# Altium project placagps.PrjPcb
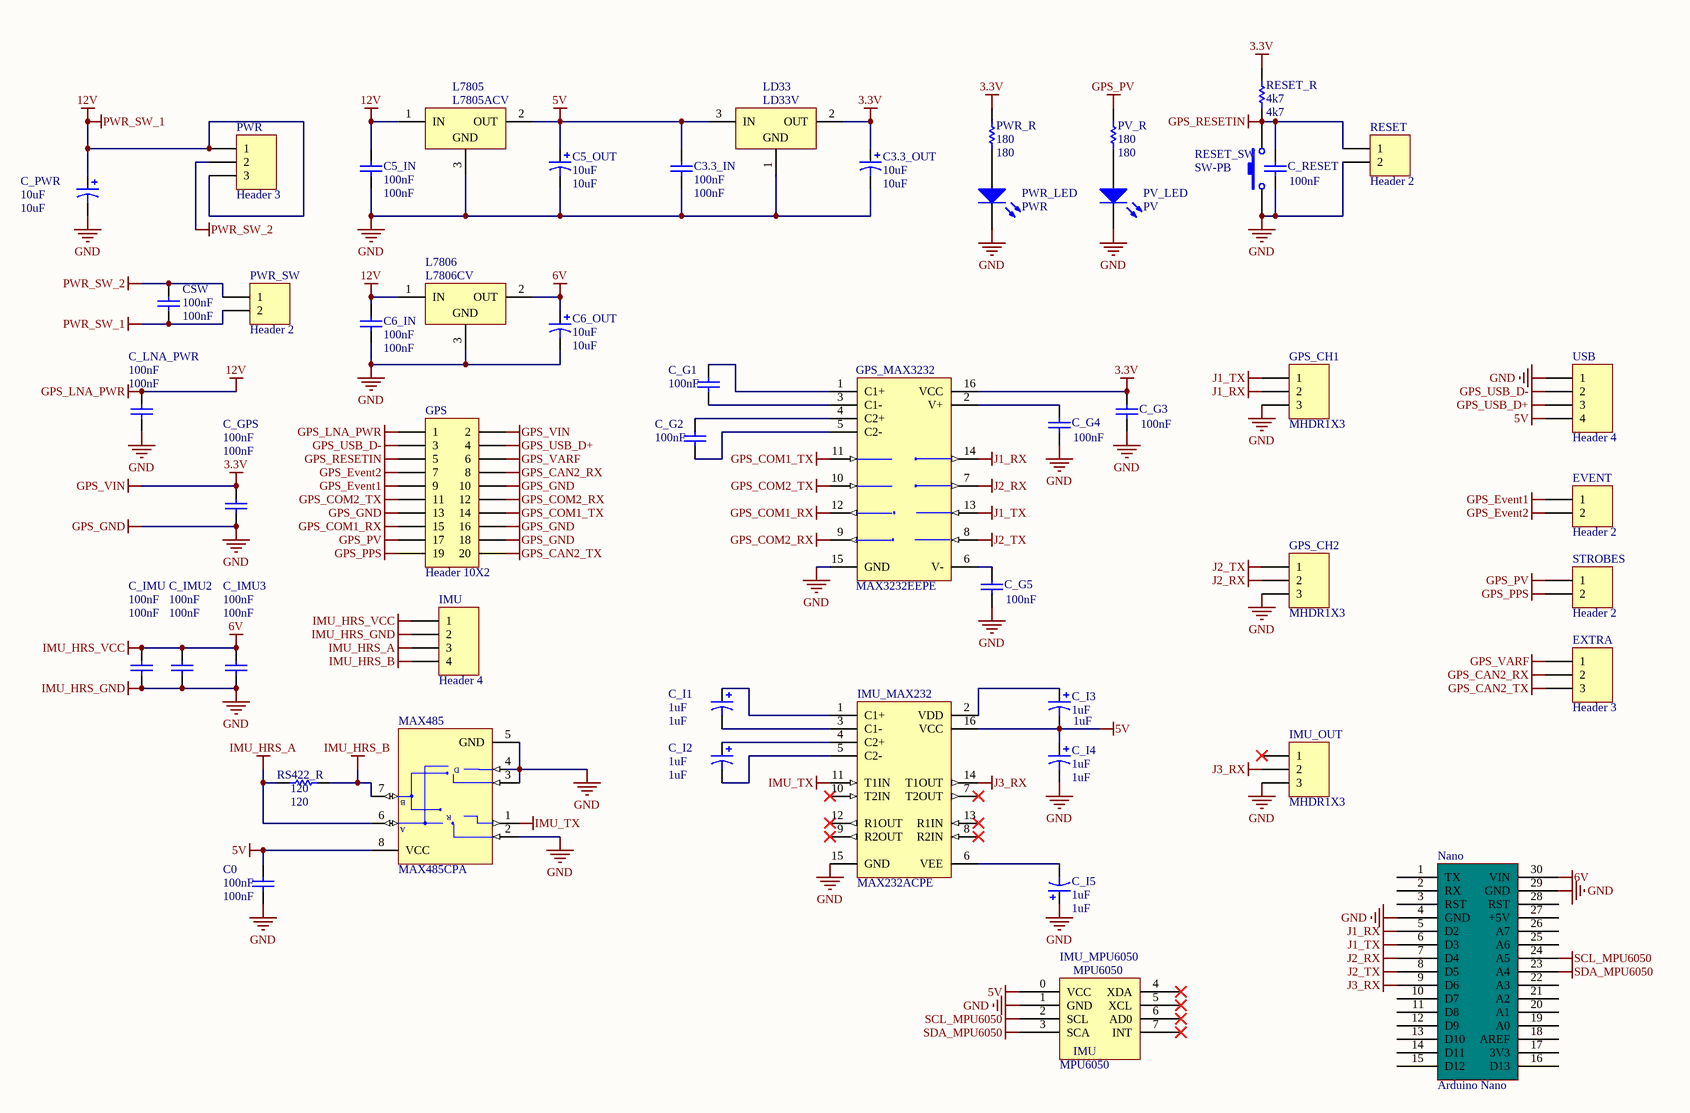
[diagram p0: schematic.SchDoc]
1 sheet, 52 parts. Net scope: global (net labels, ports and power ports of the same name join across sheets).
Board files: boardBIG (backup).PcbDoc, boardOld.PcbDoc, board.PcbDoc, boardBIG.PcbDoc, BoardBig2.PcbDoc

## Sheet schematic.SchDoc: Placa GPS/IMU
size A3; Author: George Andrew Brindeiro; Revision: RevA2; Number: v1.1; DocumentFullPathAndName: schematic.SchDoc

### Parts
C0  100nF  [C_NANO_HOLES]
C3.3_IN  100nF  [C_NANO_HOLES]
C3.3_OUT  10uF  [B]
C5_IN  100nF  [C_NANO_HOLES]
C5_OUT  10uF  [B]
C6_IN  100nF  [C_NANO_HOLES]
C6_OUT  10uF  [B]
C_G1  100nF  [C_NANO_HOLES]
C_G2  100nF  [C_NANO_HOLES]
C_G3  100nF  [C_NANO_HOLES]
C_G4  100nF  [C_NANO_HOLES]
C_G5  100nF  [C_NANO_HOLES]
C_GPS  100nF  [C_NANO_HOLES]
C_I1  1uF  [B]
C_I2  1uF  [B]
C_I3  1uF  [B]
C_I4  1uF  [B]
C_I5  1uF  [B]
C_IMU  100nF  [C_NANO_HOLES]
C_IMU2  100nF  [C_NANO_HOLES]
C_IMU3  100nF  [C_NANO_HOLES]
C_LNA_PWR  100nF  [C_NANO_HOLES]
C_PWR  10uF  [B]
C_RESET  100nF  [C_NANO_HOLES]
CSW  100nF  [C_NANO_HOLES]
EVENT  Header 2  [HDR1X2]
EXTRA  Header 3  [HDR1X3]
GPS  Header 10X2  [HDR2x10_2mm]
GPS_CH1  MHDR1X3  [HDR1X3]
GPS_CH2  MHDR1X3  [HDR1X3]
GPS_MAX3232  MAX3232EEPE  [PE16]
IMU  Header 4  [HDR1X4]
IMU_MAX232  MAX232ACPE  [PE16A]
IMU_MPU6050  MPU6050  [MPU6050]
IMU_OUT  MHDR1X3  [HDR1X3]
L7805  L7805ACV  [TO220ABN]
L7806  L7806CV  [TO220ABN]
LD33  LD33V  [T03B]
MAX485  MAX485CPA  [PA8]
Nano  Arduino Nano  [ArduinoNano]
PV_LED  PV  [HDR1X2]
PV_R  180  [AXIAL-0.3]
PWR  Header 3  [HDR1X3]
PWR_LED  PWR  [HDR1X2]
PWR_R  180  [AXIAL-0.3]
PWR_SW  Header 2  [HDR1X2]
RESET  Header 2  [HDR1X2]
RESET_R  4k7  [AXIAL-0.3]
RESET_SW  SW-PB  [PUSHBUTTON]
RS422_R  120  [AXIAL-0.3]
STROBES  Header 2  [HDR1X2]
USB  Header 4  [HDR1X4]

### Nets
3.3V: C3.3_OUT.1 C_G3.2 C_GPS.2 GPS.2 GPS_MAX3232.16(VCC) LD33.2(OUT) PWR_R.2 RESET_R.2  [also labelled GPS_VIN]
5V: C0.2 C3.3_IN.1 C5_OUT.1 C_I3.2 C_I4.1 IMU_MAX232.16(VCC) IMU_MPU6050.0(VCC) L7805.2(OUT) LD33.3(IN) MAX485.8(VCC) USB.4
6V: C6_OUT.1 C_IMU.2 C_IMU2.2 C_IMU3.2 IMU.1 L7806.2(OUT) Nano.30(VIN)  [also labelled IMU_HRS_VCC]
12V: C5_IN.1 C6_IN.1 C_LNA_PWR.2 C_PWR.1 CSW.2 GPS.1 L7805.1(IN) L7806.1(IN) PWR.1 PWR.3 PWR_SW.2  [also labelled GPS_LNA_PWR, PWR_SW_1]
GND: C0.1 C3.3_IN.2 C3.3_OUT.2 C5_IN.2 C5_OUT.2 C6_IN.2 C6_OUT.2 C_G3.1 C_G4.1 C_G5.1 C_GPS.1 C_I4.2 C_I5.1 C_IMU.1 C_IMU2.1 C_IMU3.1 C_LNA_PWR.1 C_PWR.2 C_RESET.1 GPS.10 GPS.13 GPS.16 GPS.18 GPS_CH1.3 GPS_CH2.3 GPS_MAX3232.15(GND) IMU.2 IMU_MAX232.15(GND) IMU_MPU6050.1(GND) IMU_OUT.3 L7805.3(GND) L7806.3(GND) LD33.1(GND) MAX485.2(~{RE}) MAX485.3(DE) MAX485.4(DI) MAX485.5(GND) Nano.4(GND) Nano.29(GND) PV_LED.2(K) PWR_LED.2(K) RESET.2 RESET_SW.1 USB.1  [also labelled GPS_GND, IMU_HRS_GND]
GPS_CAN2_RX: EXTRA.2 GPS.8
GPS_CAN2_TX: EXTRA.3 GPS.20
GPS_COM1_RX: GPS.15 GPS_MAX3232.12(R1OUT)
GPS_COM1_TX: GPS.14 GPS_MAX3232.11(T1IN)
GPS_COM2_RX: GPS.12 GPS_MAX3232.9(R2OUT)
GPS_COM2_TX: GPS.11 GPS_MAX3232.10(T2IN)
GPS_Event1: EVENT.1 GPS.9
GPS_Event2: EVENT.2 GPS.7
GPS_PPS: GPS.19 STROBES.2
GPS_PV: GPS.17 PV_R.2 STROBES.1
GPS_RESETIN: C_RESET.2 GPS.5 RESET.1 RESET_R.1 RESET_SW.2
GPS_USB_D+: GPS.4 USB.3
GPS_USB_D-: GPS.3 USB.2
GPS_VARF: EXTRA.1 GPS.6
IMU_HRS_A: IMU.3 MAX485.6(A) RS422_R.1
IMU_HRS_B: IMU.4 MAX485.7(B) RS422_R.2
IMU_TX: IMU_MAX232.11(T1IN) MAX485.1(RO)
J1_RX: GPS_CH1.2 GPS_MAX3232.14(T1OUT) Nano.5(D2)
J1_TX: GPS_CH1.1 GPS_MAX3232.13(R1IN) Nano.6(D3)
J2_RX: GPS_CH2.2 GPS_MAX3232.7(T2OUT) Nano.7(D4)
J2_TX: GPS_CH2.1 GPS_MAX3232.8(R2IN) Nano.8(D5)
J3_RX: IMU_MAX232.14(T1OUT) IMU_OUT.2 Nano.9(D6)
PWR_SW_2: CSW.1 PWR.2 PWR_SW.1
SCL_MPU6050: IMU_MPU6050.2(SCL) Nano.24(A5)
SDA_MPU6050: IMU_MPU6050.3(SCA) Nano.23(A4)
NetC_G1_1: C_G1.1 GPS_MAX3232.3(C1-)
NetC_G1_2: C_G1.2 GPS_MAX3232.1(C1+)
NetC_G2_1: C_G2.1 GPS_MAX3232.5(C2-)
NetC_G2_2: C_G2.2 GPS_MAX3232.4(C2+)
NetC_G4_2: C_G4.2 GPS_MAX3232.2(V+)
NetC_G5_2: C_G5.2 GPS_MAX3232.6(V-)
NetC_I1_1: C_I1.1 IMU_MAX232.1(C1+)
NetC_I1_2: C_I1.2 IMU_MAX232.3(C1-)
NetC_I2_1: C_I2.1 IMU_MAX232.4(C2+)
NetC_I2_2: C_I2.2 IMU_MAX232.5(C2-)
NetC_I3_1: C_I3.1 IMU_MAX232.2(VDD)
NetC_I5_2: C_I5.2 IMU_MAX232.6(VEE)
NetPV_LED_1: PV_LED.1(A) PV_R.1
NetPWR_LED_1: PWR_LED.1(A) PWR_R.1

Not connected (* = marked no-connect by the designer): IMU_MAX232 7(T2OUT)* 8(R2IN)* 9(R2OUT)* 10(T2IN)* 12(R1OUT)* 13(R1IN)*; IMU_MPU6050 4(XDA)* 5(XCL)* 6(AD0)* 7(INT)*; IMU_OUT 1*; Nano 1(TX) 2(RX) 3(RST) 10(D7) 11(D8) 12(D9) 13(D10) 14(D11) 15(D12) 16(D13) 17(3V3) 18(AREF) 19(A0) 20(A1) 21(A2) 22(A3) 25(A6) 26(A7) 27(+5V) 28(RST)

### Notes on the sheet
- (in symbol Component_1) IMU
- (in symbol MAX485CPA) D; R

### Library data of the parts
C0 C3.3_IN C5_IN C6_IN C_G1-C_G5 C_GPS C_IMU C_IMU2 C_IMU3 C_LNA_PWR C_RESET CSW = Cap: Capacitor; Published: 8-Jun-2000; LatestRevisionDate: 17-Jul-2002; LatestRevisionNote: Re-released for DXP Platform.; PackageReference: RAD-0.3; Publisher: Altium Limited; Value: 100nF
C3.3_OUT C5_OUT C6_OUT C_I1-C_I5 C_PWR = Cap Pol1: Polarized Capacitor (Radial); Published: 8-Jun-2000; LatestRevisionDate: 17-Jul-2002; LatestRevisionNote: Re-released for DXP Platform.; PackageReference: RB7.6-15; Publisher: Altium Limited
  C3.3_OUT C5_OUT C6_OUT C_PWR: Value: 10uF
  C_I1-C_I5: Value: 1uF
EVENT STROBES = Header 2: Header, 2-Pin; LatestRevisionDate: 17-Jul-2002; LatestRevisionNote: Re-released for DXP Platform.; Publisher: Altium Limited
EXTRA = Header 3: Header, 3-Pin; LatestRevisionDate: 17-Jul-2002; LatestRevisionNote: Re-released for DXP Platform.; Publisher: Altium Limited
GPS = Header 10X2: Header, 10-Pin, Dual row; LatestRevisionDate: 17-Jul-2002; LatestRevisionNote: Re-released for DXP Platform.; Publisher: Altium Limited
GPS_CH1 GPS_CH2 IMU_OUT = MHDR1X3: Header, 3-Pin; LatestRevisionDate: 17-Jul-2002; LatestRevisionNote: Re-released for DXP Platform.; Publisher: Altium Limited
GPS_MAX3232 = MAX3232EEPE: ±15kV ESD-Protected, 3.0V to 5.5V, Low-Power, up to 250kbps, True RS-232 Transceiver; Published: 16-Jan-2001; LatestRevisionDate: 06-Jun-2005; LatestRevisionNote: Stylized 3D Model Added.; DatasheetVersion: Mar-1999; PackageVersion: Aug-2000; PackageReference: PE16; Publisher: Altium Limited; PackageDescription: DIP; 16 Leads; Row Spacing 7.62 mm; Pitch 2.54 mm; Code_JEDEC: MS-001-BB; ComponentLink1Description: Manufacturer Link; ComponentLink1URL: http://www.maxim-ic.com/; ComponentLink2Description: Datasheet; ComponentLink2URL: http://pdfserv.maxim-ic.com/en/ds/MAX3222E-MAX3246E.pdf
IMU USB = Header 4: Header, 4-Pin; LatestRevisionDate: 17-Jul-2002; LatestRevisionNote: Re-released for DXP Platform.; Publisher: Altium Limited
IMU_MAX232 = MAX232ACPE: +5V Powered, Multi-Channel RS-232 Driver/Receiver; Published: 16-Jan-2001; LatestRevisionDate: 06-Jun-2005; LatestRevisionNote: Stylized 3D Model Added.; PackageVersion: 1997; PackageReference: PE16A; Publisher: Altium Limited; PackageDescription: DIP; 16 Leads; Row Spacing 7.62 mm; Pitch 2.54 mm; Code_JEDEC: MS-001-BB; ComponentLink1Description: Manufacturer Link; ComponentLink1URL: http://www.maxim-ic.com/; ComponentLink2Description: Datasheet; ComponentLink2URL: http://pdfserv.maxim-ic.com/en/ds/MAX220-MAX249.pdf
IMU_MPU6050 Nano = Component_1
L7805 = L7805ACV: Precision 1A Regulator; Note: Tab is connected to pin 3 (GND).; Published: 24-Aug-2001; LatestRevisionDate: 17-Jul-2002; LatestRevisionNote: Re-released for DXP Platform.; DatasheetVersion: Nov-1999; PackageVersion: Jun-1998; PackageReference: TO220ABN; Publisher: Altium Limited; PackageDescription: TO, Thru-Hole, Vertical, Heatsink Mounted; 3 In-Line Leads; Pitch 2.54 mm; Pin sequence 1, 3, 2; ComponentLink1Description: Manufacturer Link; ComponentLink1URL: http://www.st.com/; ComponentLink2Description: Datasheet; ComponentLink2URL: http://www.st.com/stonline/products/literature/ds/2144/l7805ab.pdf
L7806 = L7806CV: Positive Voltage Regulator; Note: Tab is connected to pin 3 (GND).; Published: 24-Aug-2001; LatestRevisionDate: 17-Jul-2002; LatestRevisionNote: Re-released for DXP Platform.; DatasheetVersion: Dec-1998; PackageVersion: Jun-1998; PackageReference: TO220ABN; Publisher: Altium Limited; PackageDescription: TO, Thru-Hole, Vertical, Heatsink Mounted; 3 In-Line Leads; Pitch 2.54 mm; Pin sequence 1, 3, 2; ComponentLink1Description: Manufacturer Link; ComponentLink1URL: http://www.st.com/
LD33 = LM1117T-3.3: 800mA Low-Dropout Linear Regulator; Manufacturer: National Semiconductor; CompType: LDO IC; PackageTopMarking: NSUZXYTTE#*LM1117T*3.3; Published: 4-Dec-2008; DatasheetVersion: Apr-2006; PackageVersion: revL, Jan-1992; PackageReference: T03B; Publisher: Altium Limited; PackageDescription: TO-220, Molded, 3 Lead, Straight; PartNumber: LM1117T-3.3; RoHS: O; PinCount: 3; DigiKeyPartNumber: LM1117T-3.3-ND; ComponentLink1Description: LM1117 Datasheet; ComponentLink1URL: http://www.national.com/ds/LM/LM1117.pdf; ComponentLink2Description: LM1117 Web Page; ComponentLink2URL: http://www.national.com/pf/LM/LM1117.html; ComponentLink3Description: T03B Package Page; ComponentLink3URL: http://www.national.com/packaging/folders/t03b.html
MAX485 = MAX485CPA: Low-Power, Slew-Rate-Limited RS-485/RS-422 Transceiver; Published: 16-Jan-2001; LatestRevisionDate: 29-May-2009; LatestRevisionNote: Component Body Added.; DatasheetVersion: Feb-1996; PackageVersion: RevB, 21-0043; PackageReference: PA8; Publisher: Altium Limited; PackageDescription: DIP, 8-Pin, Row Spacing 7.62 mm, Pitch 2.54 mm; Code_JEDEC: MS-001-AB; ComponentLink1Description: Manufacturer Link; ComponentLink1URL: http://www.maxim-ic.com/; ComponentLink2Description: Datasheet; ComponentLink2URL: http://pdfserv.maxim-ic.com/en/ds/MAX1487-MAX491.pdf
PV_LED PWR_LED = LED0: Typical INFRARED GaAs LED; Published: 8-Jun-2000; LatestRevisionDate: 08-Jul-2005; LatestRevisionNote: Mech Layer 1 removed.; PackageReference: LED-0; Publisher: Altium Limited
PV_R PWR_R RESET_R RS422_R = Res1: Resistor; Published: 8-Jun-2000; LatestRevisionDate: 17-Jul-2002; LatestRevisionNote: Re-released for DXP Platform.; PackageReference: AXIAL-0.3; Publisher: Altium Limited
  PV_R PWR_R: Value: 180
  RESET_R: Value: 4k7
  RS422_R: Value: 120
PWR = Header 3H: Header, 3-Pin, Right Angle; LatestRevisionDate: 17-Jul-2002; LatestRevisionNote: Re-released for DXP Platform.; Publisher: Altium Limited
PWR_SW RESET = Header 2H: Header, 2-Pin, Right Angle; LatestRevisionDate: 17-Jul-2002; LatestRevisionNote: Re-released for DXP Platform.; Publisher: Altium Limited
RESET_SW = SW-PB: Switch; Published: 24-Mar-1999; LatestRevisionDate: 17-Jul-2002; LatestRevisionNote: Re-released for DXP Platform.; PackageReference: SPST-2; Publisher: Altium Limited